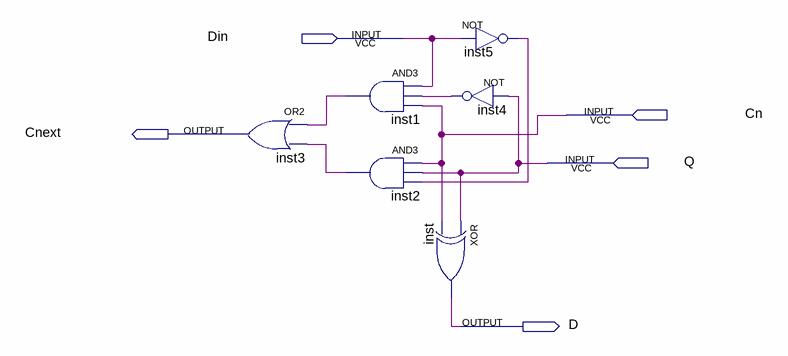
[diagram p0: schematic sheet]
// Quartus schematic HAS.bdf as structural Verilog: 6 symbols, 5 pins
module HAS (
  input  Din,
  input  Cn,
  input  Q,
  output Cnext,
  output D
);

  wire inst1_out, inst2_out, inst4_out, inst5_out;

  or inst3 (Cnext, inst1_out, inst2_out);
  and inst1 (inst1_out, Din, inst4_out, Cn);
  and inst2 (inst2_out, Cn, Q, inst5_out);
  xor inst (D, Q, Cn);
  not inst5 (inst5_out, Din);
  not inst4 (inst4_out, Q);
endmodule
